# EAGLE design main (EAGLE 7.6.0)
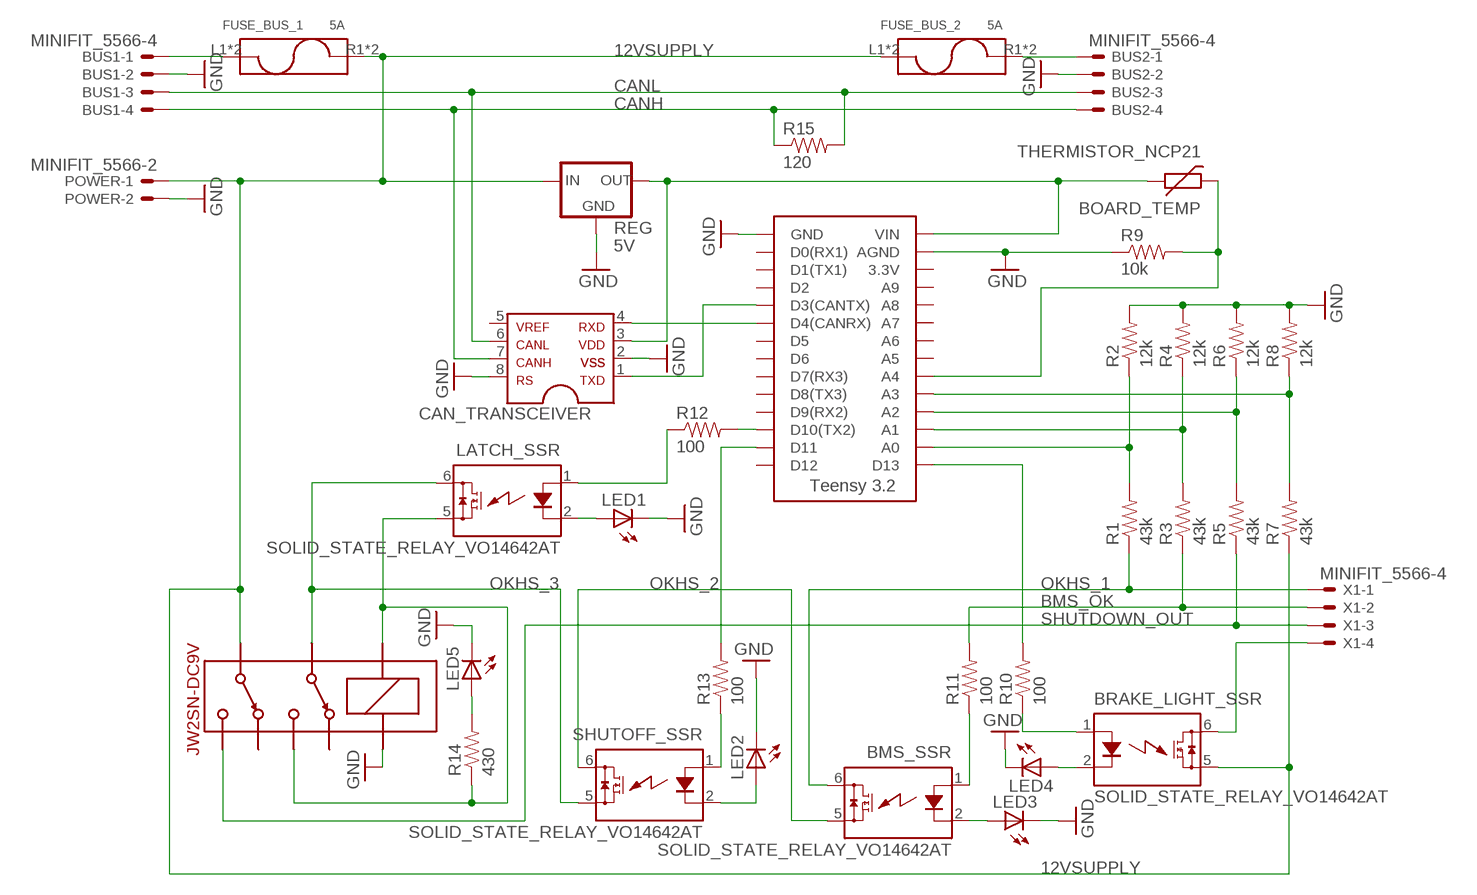
[diagram p0: schematic, sheet 1]

## Parts
BMS_SSR  SOLID_STATE_RELAY_VO14642AT  [DIL06]
BOARD_TEMP  THERMISTOR_NCP21  [0805]
BRAKE_LIGHT_SSR  SOLID_STATE_RELAY_VO14642AT  [DIL06]
BUS1  MINIFIT_5566-4  [MINIFIT_5566-4]
BUS2  MINIFIT_5566-4  [MINIFIT_5566-4]
CAN_TRANSCEIVER  MCP2551DIL  [DIL08]
FUSE_BUS_1  5A  FUSE_HOLDER  [FUSE_HOLDER]
FUSE_BUS_2  5A  FUSE_HOLDER  [FUSE_HOLDER]
IMD_SHUTDOWN  DPDT_RELAY_PANASONIC_JW2SN-DC9V  [DPDT_RELAY_PANASONIC_JW2SN]
LATCH_SSR  SOLID_STATE_RELAY_VO14642AT  [DIL06]
LED1  LED-0805  [LED-805]
LED2  LED-0805  [LED-805]
LED3  LED-0805  [LED-805]
LED4  LED-0805  [LED-805]
LED5  LED-0805  [LED-805]
POWER  MINIFIT_5566-2  [MINIFIT_5566-2]
R1  43k  RESISTOR0805-RES  [0805]
R2  12k  RESISTOR0805-RES  [0805]
R3  43k  RESISTOR0805-RES  [0805]
R4  12k  RESISTOR0805-RES  [0805]
R5  43k  RESISTOR0805-RES  [0805]
R6  12k  RESISTOR0805-RES  [0805]
R7  43k  RESISTOR0805-RES  [0805]
R8  12k  RESISTOR0805-RES  [0805]
R9  10k  RESISTOR0805-RES  [0805]
R10  100  RESISTOR0805-RES  [0805]
R11  100  RESISTOR0805-RES  [0805]
R12  100  RESISTOR0805-RES  [0805]
R13  100  RESISTOR0805-RES  [0805]
R14  430  RESISTOR0805-RES  [0805]
R15  120  RESISTOR0805-RES  [0805]
REG  5V  5V_REGULATOR_LM340-NLM340MPX-5.0/NOPB  [SOT223]
SHUTOFF_SSR  SOLID_STATE_RELAY_VO14642AT  [DIL06]
U$3  TEENSY_3.2_SIMPLE  [TEENSY_3.2_SIMPLE]
X1  MINIFIT_5566-4  [MINIFIT_5566-4]

## Nets
5VSUPPLY: BOARD_TEMP.1 CAN_TRANSCEIVER.3 REG.3(OUT) U$3.VIN
12VSUPPLY: BRAKE_LIGHT_SSR.5(IO2) FUSE_BUS_1.R1 FUSE_BUS_1.R2 FUSE_BUS_2.L1 FUSE_BUS_2.L2 IMD_SHUTDOWN.6 POWER.1 R7.1 REG.1(IN)
12VSUPPLY_READ: R7.2 R8.1 U$3.A3
BMS_OK: R3.1 R11.2 X1.2
BMS_OK_READ: R3.2 R4.1 U$3.A1
CANH: BUS1.4 BUS2.4 CAN_TRANSCEIVER.7 R15.1
CANL: BUS1.3 BUS2.3 CAN_TRANSCEIVER.6 R15.2
GND: BUS1.2 BUS2.2 CAN_TRANSCEIVER.2 CAN_TRANSCEIVER.8 IMD_SHUTDOWN.COIL+ LED1.C LED2.C LED3.C LED4.C LED5.C POWER.2 R2.2 R4.2 R6.2 R8.2 R9.1 REG.2(GND) REG.4(GND) U$3.AGND U$3.GND
N$1: LATCH_SSR.2(LED-) LED1.A
N$2: CAN_TRANSCEIVER.4 U$3.D4(CANRX)
N$3: CAN_TRANSCEIVER.1 U$3.D3(CANTX)
N$4: BRAKE_LIGHT_SSR.6(IO1) X1.4
N$5: R12.2 U$3.D10(TX2)
N$6: IMD_SHUTDOWN.4 IMD_SHUTDOWN.COIL- LATCH_SSR.5(IO2) R14.1
N$7: BRAKE_LIGHT_SSR.2(LED-) LED4.A
N$8: LATCH_SSR.1(LED+) R12.1
N$9: BMS_SSR.2(LED-) LED3.A
N$10: BUS1.1 FUSE_BUS_1.L1 FUSE_BUS_1.L2
N$11: BUS2.1 FUSE_BUS_2.R1 FUSE_BUS_2.R2
N$12: R13.1 SHUTOFF_SSR.1(LED+)
N$13: R10.2 U$3.D13
N$14: R13.2 U$3.D11
N$15: BOARD_TEMP.2 R9.2 U$3.A4
N$16: LED2.A SHUTOFF_SSR.2(LED-)
N$17: BRAKE_LIGHT_SSR.1(LED+) R10.1
N$18: BMS_SSR.1(LED+) R11.1
N$19: LED5.A R14.2
OKHS_1: BMS_SSR.6(IO1) R1.1 X1.1
OKHS_2: BMS_SSR.5(IO2) SHUTOFF_SSR.6(IO1)
OKHS_3: IMD_SHUTDOWN.3 LATCH_SSR.6(IO1) SHUTOFF_SSR.5(IO2)
OKHS_READ: R1.2 R2.1 U$3.A0
SHUTDOWN_OUT: IMD_SHUTDOWN.5 R5.1 X1.3
SHUTDOWN_OUT_READ: R5.2 R6.1 U$3.A2
Unconnected: CAN_TRANSCEIVER.5 IMD_SHUTDOWN.2 IMD_SHUTDOWN.7 U$3.3.3V U$3.A5 U$3.A6 U$3.A7 U$3.A8 U$3.A9 U$3.D0(RX1) U$3.D1(TX1) U$3.D2 U$3.D5 U$3.D6 U$3.D7(RX3) U$3.D8(TX3) U$3.D9(RX2) U$3.D12

## Library data of the parts
BMS_SSR BRAKE_LIGHT_SSR LATCH_SSR SHUTOFF_SSR = HyTechDevices:SOLID_STATE_RELAY
BOARD_TEMP = HyTechDevices:THERMISTOR_NCP21: Murata NCP21 10k Thermistor Datasheet <http://www.murata.com/~/media/webrenewal/support/library/catalog/products/thermistor/ntc/r44e.ashx>
BUS1 BUS2 X1 = HyTechDevices:MINIFIT_5566-4: Mini FIT Junior connector 4 pole Source: http://www.molex.com; OC_FARNELL: unknown; OC_NEWARK: unknown
CAN_TRANSCEIVER = HyTechDevices:MCP2551: MCP2551 High-Speed CAN Transceiver Product Webpage <https://www.microchip.com/wwwproducts/en/MCP2551> Datasheet <http://ww1.microchip.com/downloads/en/DeviceDoc/21667f.pdf> This device is outdated It is replaced by MCP2561. Comparison Page <https://www.microchip.com/wwwproducts/ProductCompare/MCP2551/MCP2561> Product Webpage <https://www.microchip.com/wwwproducts/en/MCP2561> Datasheet <http://ww1.microchip.com/downloads/en/DeviceDoc/20005167C.pdf>
FUSE_BUS_1 FUSE_BUS_2 = HyTechDevices:FUSE_HOLDER: Keystone Electronics 3568 Fuse Mouser Part <http://www.mouser.com/ProductDetail/Keystone-Electronics/3568> Datasheet <http://www.mouser.com/ds/2/215/568-742601.pdf>
IMD_SHUTDOWN = HyTechDevices:DPDT_RELAY_PANASONIC_JW2SN-DC9V: Double Pull Double Throw Relay 9VDC Datasheet <http://www.mouser.com/ds/2/316/jw-catalog-461998.pdf> Product Page <http://www.mouser.com/ProductDetail/Panasonic-Industrial-Devices/JW2SN-DC9V>
LED1-LED5 = HyTechDevices:LED: Light Emitting Diode Source: Dangerous Prototypes Eagle Library <https://github.com/DangerousPrototypes/Eagle_Part_Library>
POWER = HyTechDevices:MINIFIT_5566-2: Mini FIT Junior connector 2 pole Source: http://www.molex.com; OC_FARNELL: 1822072; OC_NEWARK: unknown
R1-R15 = HyTechDevices:RESISTOR: Resistor Basic schematic elements and footprints for 0603, 1206, and PTH resistors.
REG = HyTechDevices:5V_REGULATOR_LM340-N: Voltage Regulator 5v linear voltage regulator Datasheet <http://www.mouser.com/ProductDetail/Texas-Instruments/LM340MPX-50-NOPB/?qs=X1J7HmVL2ZGZwtTFRQ9ItA%3D%3D> MAX current out: 1.5A MAX voltage in: 35V
U$3 = HyTechDevices:TEENSY_3.2_SIMPLE: Simple version of the Teensy 3.2 board that only uses the 2 main rows of pins, not the inner pins or the pins opposite the usb port.

## Board
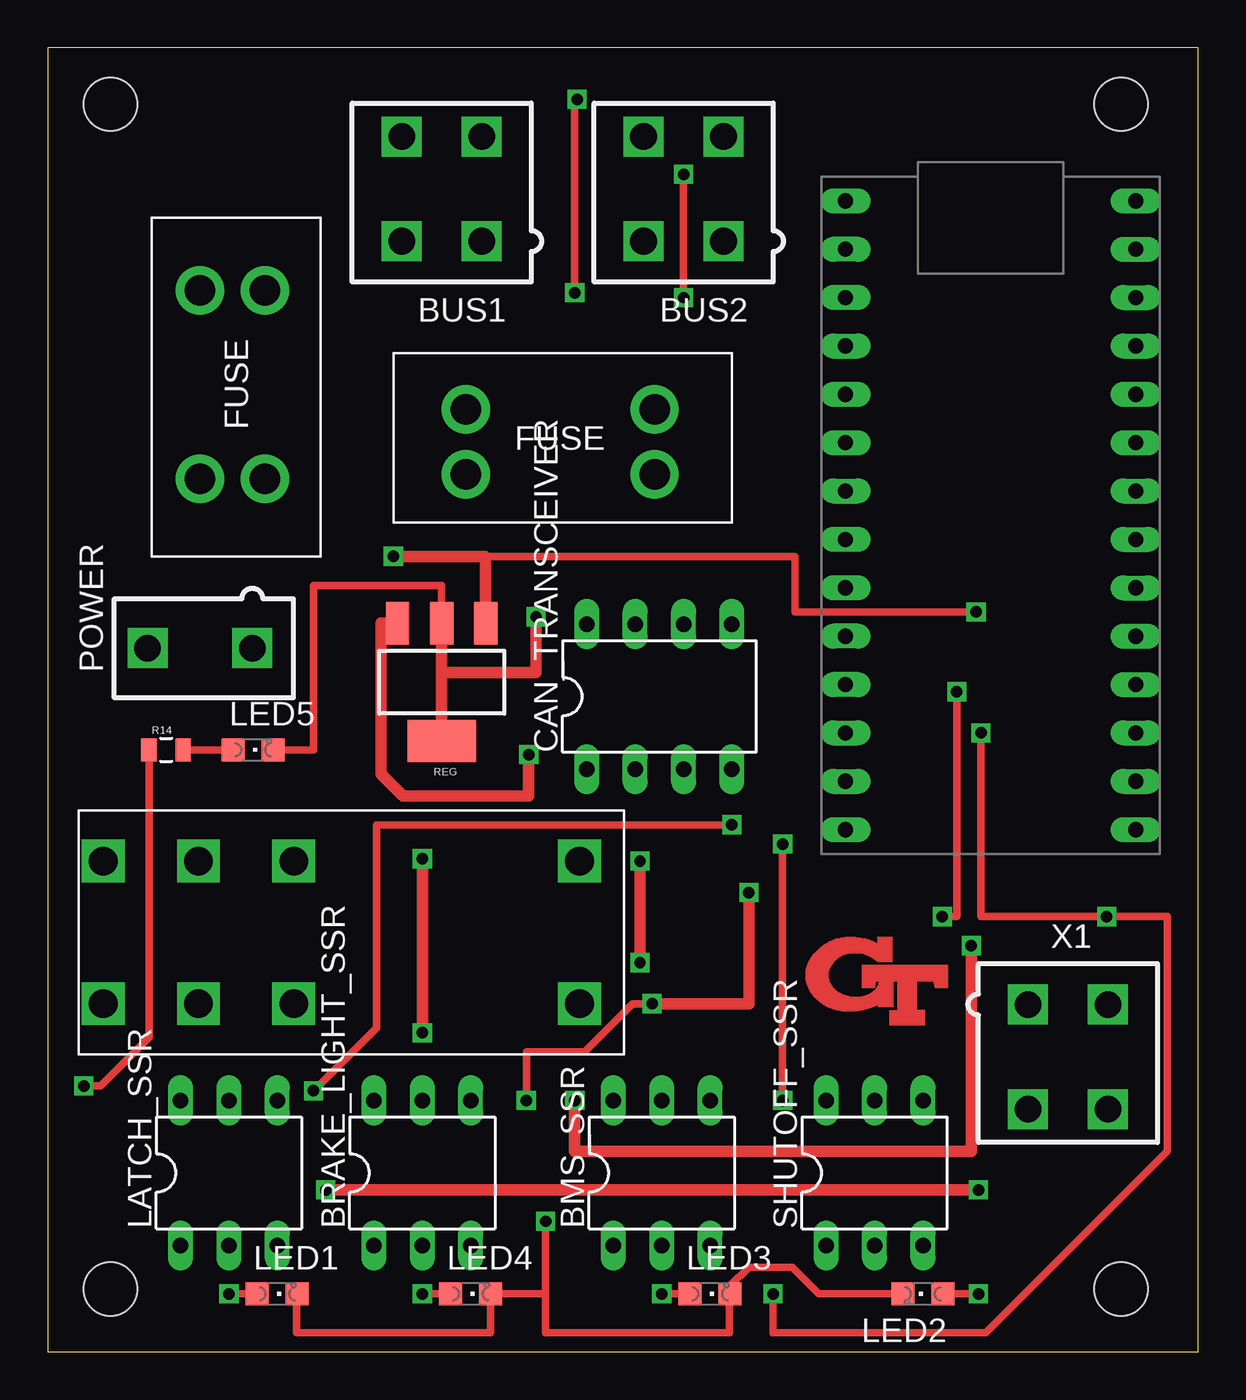
[diagram p1: board, top side]
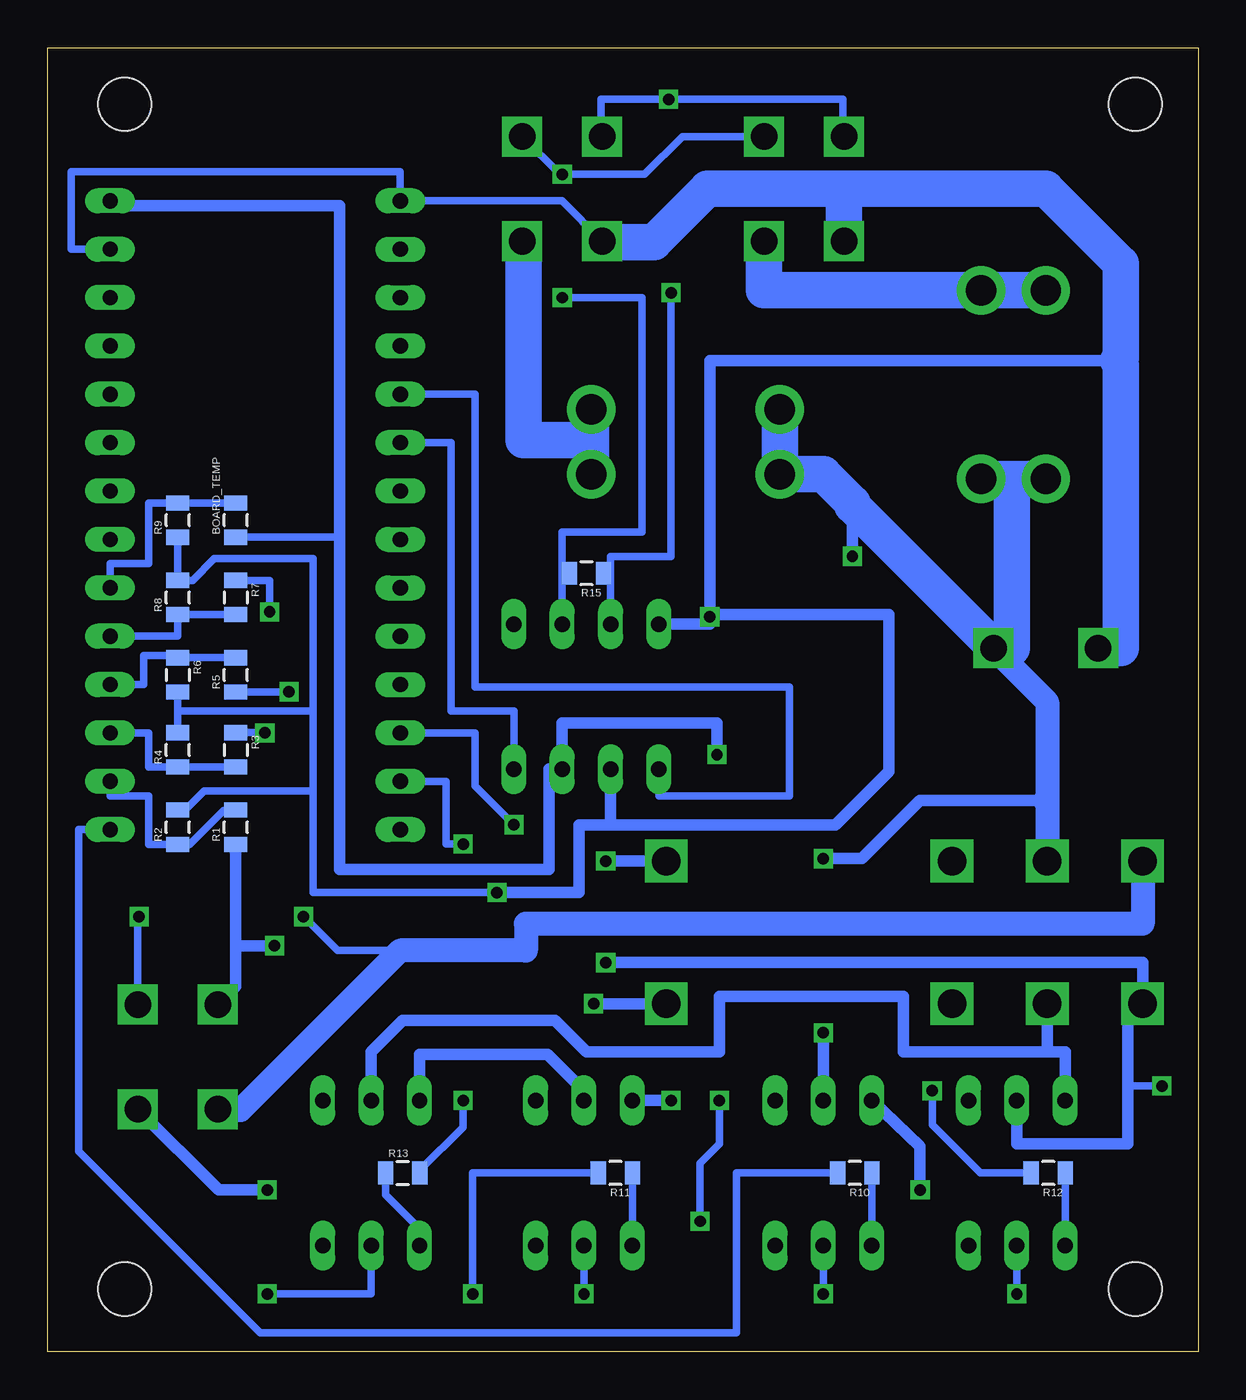
[diagram p2: board, bottom side, seen from below]

Size 60.43 x 68.5 mm. Coordinates in mm from the lower left corner, seen from the top.
Outline: 0,0 60.43,0 60.43,68.5 0,68.5 0,0
Copper layers (1*16): Top 0.035mm / dielectric 1.5mm / Bottom 0.035mm
Design rules "default": minimum track width 10mil, minimum drill 24mil, track to track 8mil, track to pad 8mil, pad to pad 8mil, via to via 8mil, smd to smd 8mil, copper to edge 40mil, drill to drill 8mil, minimum pad ring 10mil, minimum via ring 8mil, stop-mask expansion 4mil, vias tented up to drill 0mil, thermal gap 10mil
Holes 2.8 mm at 3.3,65.53 3.3,3.3 56.39,3.3 56.39,65.53

### Footprints (pad centres in the part's own frame; a part is rotated, then mirrored left to right if it is on the bottom)
DIL06 = drill 0.813 long: 1 -2.54,-3.81; 2 0,-3.81; 3 2.54,-3.81; 4 2.54,3.81; 5 0,3.81; 6 -2.54,3.81
0805 = smd 0.8 x 1.2: 1 -0.9,0; 2 0.9,0
MINIFIT_5566-4 = drill 1.4 square: 1 2.1,-2.75; 2 -2.1,-2.75; 3 2.1,2.75; 4 -2.1,2.75
DIL08 = drill 0.813 long: 1 -3.81,-3.81; 2 -1.27,-3.81; 3 1.27,-3.81; 4 3.81,-3.81; 5 3.81,3.81; 6 1.27,3.81; 7 -1.27,3.81; 8 -3.81,3.81
FUSE_HOLDER = drill 1.6 pad 2.54: L1 0,3.404; L2 0,0; R1 9.906,3.404; R2 9.906,0
DPDT_RELAY_PANASONIC_JW2SN = drill 1.5 square: 2 10.008,0; 3 5.004,0; 4 0,0; 5 0,7.493; 6 5.004,7.493; 7 10.008,7.493; COIL+ 25.019,0; COIL- 25.019,7.493
LED-805 = smd 1.2 x 1.2: A 0,-1.05; C 0,1.05
MINIFIT_5566-2 = drill 1.4 square: 1 0,-2.75; 2 0,2.75
SOT223 = smd 1.219 x 2.235: 1 -2.311,-3.099; 2 0,-3.099; 3 2.311,-3.099 | smd 3.6 x 2.2: 4 0,3.099
TEENSY_3.2_SIMPLE = drill 0.8 long: 3.3V 16.51,29.21; A0 16.51,3.81; A1 16.51,6.35; A2 16.51,8.89; A3 16.51,11.43; A4 16.51,13.97; A5 16.51,16.51; A6 16.51,19.05; A7 16.51,21.59; A8 16.51,24.13; A9 16.51,26.67; AGND 16.51,31.75; D0(RX1) 1.27,31.75; D1(TX1) 1.27,29.21; D2 1.27,26.67; D3(CANTX) 1.27,24.13; D4(CANRX) 1.27,21.59; D5 1.27,19.05; D6 1.27,16.51; D7(RX3) 1.27,13.97; D8(TX3) 1.27,11.43; D9(RX2) 1.27,8.89; D10(TX2) 1.27,6.35; D11 1.27,3.81; D12 1.27,1.27; D13 16.51,1.27; GND 1.27,34.29; VIN 16.51,34.29

### Placement (x,y rotation side)
BMS_SSR  32.26,9.4 0 top
BOARD_TEMP  50.55,43.69 90 bottom
BRAKE_LIGHT_SSR  19.68,9.4 0 top
BUS1  20.7,61.09 0 top
BUS2  33.4,61.09 0 top
CAN_TRANSCEIVER  32.13,34.42 0 top
FUSE_BUS_1  8,55.75 270 top
FUSE_BUS_2  21.97,46.1 0 top
IMD_SHUTDOWN  2.92,18.29 0 top
LATCH_SSR  9.53,9.4 0 top
LED1  12.06,3.05 270 top
LED2  45.97,3.05 90 top
LED3  34.8,3.05 270 top
LED4  22.23,3.05 270 top
LED5  10.79,31.62 270 top
POWER  8,36.96 90 top
R1  50.55,27.56 90 bottom
R2  53.59,27.56 90 bottom
R3  50.55,31.62 270 bottom
R4  53.59,31.62 90 bottom
R5  50.55,35.56 90 bottom
R6  53.59,35.56 270 bottom
R7  50.55,39.62 270 bottom
R8  53.59,39.62 90 bottom
R9  53.59,43.69 90 bottom
R10  18.03,9.4 180 bottom
R11  30.61,9.4 180 bottom
R12  7.87,9.4 180 bottom
R13  41.78,9.4 0 bottom
R14  6.22,31.62 0 top
R15  32.13,40.89 180 bottom
REG  20.7,35.18 180 top
SHUTOFF_SSR  43.43,9.4 0 top
U$3  40.64,26.16 0 top
X1  53.59,15.49 180 top

### Tracks (layer width: path | path; a pad name or v marks a point on that pad's centre or on a via)
5VSUPPLY  (via drill 0.6)
  Top 0.61: REG.3 17.53,38.28 17.53,30.35 18.67,29.21 25.27,29.21 v25.27,31.37
  Bottom 0.406: BOARD_TEMP.1 45.09,42.79 45.09,43.18
  Bottom 0.61: v25.27,31.37 25.27,33.02 33.4,33.02 CAN_TRANSCEIVER.3 34.09,30.61 34.09,25.35 45.09,25.35 45.09,43.18 45.09,60.2 57.15,60.2 U$3.VIN
12VSUPPLY  (via drill 0.6)
  Top 0.406: 22.99,41.78 39.24,41.78 39.24,38.86 v48.77,38.86
  Top 0.61: v18.16,41.78 22.99,41.78 23.01,41.76 REG.1 23.11,37.52 | v19.68,25.91 v19.68,16.76
  Bottom 0.406: R7.1 48.77,40.52 v48.77,38.86
  Bottom 0.61: v18.16,41.78 18.16,44.45 18.16,44.58 | v19.68,16.76 BRAKE_LIGHT_SSR.5 | 8.05,28.96 14.61,28.96 17.65,25.91 v19.68,25.91
  Bottom 1.27: POWER.1 7.92,34.13 7.92,28.83 | 7.92,28.83 IMD_SHUTDOWN.6 | 8.05,28.96 7.92,28.83
  Bottom 1.905: FUSE_BUS_2.L1 FUSE_BUS_2.L2 19.68,46.1 18.16,44.58 | FUSE_BUS_1.R2 FUSE_BUS_1.R1 9.78,45.85 9.78,36.96 POWER.1 10.75,37.17 10.88,37.17 18.16,44.45
12VSUPPLY_READ
  Bottom 0.406: R7.2 R8.1 53.59,37.59 U$3.A3
BMS_OK  (via drill 0.6)
  Top 0.406: v49.02,32.51 49.02,22.86 v55.63,22.86 58.8,22.86 58.8,10.54 49.28,1.02 38.1,1.02 v38.1,3.05
  Bottom 0.406: R3.1 49.02,32.52 v49.02,32.51 | v55.63,22.86 55.69,22.86 X1.2 | R11.2 38.1,9.4 v38.1,3.05
BMS_OK_READ
  Bottom 0.406: R3.2 R4.1 55.12,30.72 55.12,32.51 U$3.A1
CANH  (via drill 0.6)
  Top 0.406: v27.81,65.79 27.69,65.79 v27.69,55.63
  Bottom 0.406: BUS2.4 31.37,63.84 31.37,65.79 v27.81,65.79 18.67,65.79 18.67,63.84 BUS1.4 | v27.69,55.63 27.69,41.78 30.86,41.78 30.86,40.89 | 30.86,40.89 CAN_TRANSCEIVER.7 | R15.1 30.86,40.89
CANL  (via drill 0.6)
  Top 0.406: v33.4,55.37 v33.4,61.85
  Bottom 0.406: BUS2.3 33.51,61.85 v33.4,61.85 29.08,61.85 27.09,63.84 BUS1.3 | v33.4,55.37 29.21,55.37 29.21,43.05 33.4,43.05 33.4,40.89 | 33.4,40.89 CAN_TRANSCEIVER.6 | R15.2 33.4,40.89
GND  (via drill 0.6)
  Top 0.406: v31.75,18.29 30.73,18.29 28.19,15.75 25.15,15.75 v25.15,13.21 | 26.16,3.05 LED4.C 23.27,1.02 13.08,1.02 13.08,3.05 LED1.C | 26.16,3.05 v26.16,6.86 | 26.16,3.05 26.16,1.02 35.81,1.02 35.81,3.05 LED3.C 35.85,3.46 36.83,4.45 39.12,4.45 40.51,3.05 LED2.C | REG.2 20.7,40.26 13.97,40.26 13.97,31.62 LED5.C
  Top 0.61: v31.75,18.29 36.83,18.29 v36.83,24.13 | REG.2 20.7,35.69 | 20.7,35.69 25.65,35.69 v25.65,38.61 | REG.4 20.7,35.69
  Bottom 0.406: BUS2.2 33.42,60.45 U$3.GND 41.91,61.98 59.18,61.98 59.18,57.91 U$3.AGND | R9.1 R8.2 | R4.2 53.59,33.53 | 53.59,33.53 R6.2 | R8.2 52.82,40.52 51.69,41.66 46.48,41.66 46.48,33.66 | 46.48,33.66 53.47,33.66 53.59,33.53 | R2.2 53.2,28.46 52.2,29.46 46.48,29.46 | 46.48,29.46 46.48,33.66 | 53.59,40.39 R8.2 | 46.48,29.46 46.48,24.13 v36.83,24.13 | 25.65,38.73 v25.65,38.61 25.65,38.23 | 4.19,52.07 4.06,51.82 | v26.16,6.86 26.16,9.91 25.15,10.92 v25.15,13.21
  Bottom 0.61: 30.86,27.69 19.05,27.69 16.26,30.48 16.26,38.73 25.65,38.73 | 30.86,27.69 CAN_TRANSCEIVER.2 | v36.83,24.13 32.51,24.13 32.51,27.69 30.86,27.69 | v25.65,38.61 25.65,52.07 4.19,52.07 | CAN_TRANSCEIVER.8 25.65,38.23 | IMD_SHUTDOWN.COIL+ v31.75,18.29
  Bottom 1.905: 18.6,61.09 BUS1.2 | POWER.2 4.06,36.96 4.06,51.82 | 18.6,61.09 25.78,61.09 28.57,58.29 31.26,58.29 BUS2.2 | 18.6,61.09 8,61.09 4.06,57.15 4.06,52.2 4.19,52.07
N$1  (via drill 0.6)
  Top 0.406: v9.53,3.05 LED1.A
  Bottom 0.406: LATCH_SSR.2 v9.53,3.05
N$2
  Bottom 0.406: CAN_TRANSCEIVER.4 35.94,33.66 39.24,33.66 39.24,47.75 U$3.D4(CANRX)
N$3
  Bottom 0.406: CAN_TRANSCEIVER.1 28.32,29.21 21.46,29.21 21.46,34.92 37.97,34.92 37.97,50.29 U$3.D3(CANTX)
N$4  (via drill 0.6)
  Top 0.61: v14.61,8.51 v48.9,8.51
  Bottom 0.61: X1.4 51.46,8.51 v48.9,8.51 | v14.61,8.51 14.61,10.79 BRAKE_LIGHT_SSR.6
N$5  (via drill 0.6)
  Top 0.406: v35.94,27.69 17.27,27.69 17.27,17.02 v13.97,13.72
  Bottom 0.406: U$3.D10(TX2) 37.97,32.51 37.97,29.72 v35.94,27.69 | v13.97,13.72 13.97,11.94 11.43,9.4 R12.2
N$6  (via drill 0.6)
  Top 0.406: v1.91,13.97 2.79,13.97 5.33,16.51 5.33,31.61 R14.1
  Top 0.61: v31.11,25.78 v31.11,20.45
  Bottom 0.406: 3.68,13.98 v1.91,13.98 v1.91,13.97
  Bottom 0.61: LATCH_SSR.5 9.53,10.92 3.68,10.92 3.68,13.98 3.68,18.29 IMD_SHUTDOWN.4 2.92,20.45 v31.11,20.45 | IMD_SHUTDOWN.COIL- v31.11,25.78
N$7  (via drill 0.6)
  Top 0.406: v19.68,3.05 LED4.A
  Bottom 0.406: BRAKE_LIGHT_SSR.2 v19.68,3.05
N$8
  Bottom 0.406: R12.1 6.99,9.4 LATCH_SSR.1
N$9  (via drill 0.6)
  Top 0.406: v32.26,3.05 LED3.A
  Bottom 0.406: BMS_SSR.2 v32.26,3.05
N$10
  Bottom 1.905: FUSE_BUS_1.L2 FUSE_BUS_1.L1 22.8,55.75 BUS1.1
N$11
  Bottom 1.905: FUSE_BUS_2.R2 FUSE_BUS_2.R1 31.88,47.88 35.43,47.88 35.43,58.34 BUS2.1
N$12
  Bottom 0.406: SHUTOFF_SSR.1 40.89,6.48 42.67,8.26 42.67,9.39 R13.1
N$13
  Bottom 0.406: R10.2 24.26,9.4 24.26,1.02 49.28,1.02 58.8,10.54 58.8,27.43 U$3.D13
N$14  (via drill 0.6)
  Top 0.406: v38.61,26.67 v38.61,13.21
  Bottom 0.406: v38.61,26.67 39.5,26.67 39.5,29.97 U$3.D11 | R13.2 40.88,9.53 38.61,11.8 v38.61,13.21
N$15
  Bottom 0.406: BOARD_TEMP.2 R9.2 55.12,44.59 55.12,41.4 57.15,41.4 U$3.A4
N$16  (via drill 0.6)
  Top 0.406: v48.9,3.05 LED2.A
  Bottom 0.406: SHUTOFF_SSR.2 43.43,3.05 v48.9,3.05
N$17
  Bottom 0.406: R10.1 17.14,9.4 BRAKE_LIGHT_SSR.1
N$18
  Bottom 0.406: BMS_SSR.1 29.71,5.59 R11.1
N$19
  Top 0.406: R14.2 LED5.A
OKHS_1  (via drill 0.6)
  Top 0.61: v48.51,21.34 48.51,10.54 27.69,10.54 v27.69,13.21
  Bottom 0.406: R1.1 50.81,26.66 50.81,26.41
  Bottom 0.61: R1.1 50.55,21.34 | X1.1 50.55,19.19 50.55,21.34 | 50.55,21.34 v48.51,21.34 | v27.69,13.21 BMS_SSR.6
OKHS_2
  Bottom 0.61: BMS_SSR.5 32.26,13.72 34.16,15.62 40.89,15.62 SHUTOFF_SSR.6
OKHS_3
  Bottom 0.61: 7.92,15.75 IMD_SHUTDOWN.3 | LATCH_SSR.6 6.99,15.75 7.92,15.75 | 7.92,15.75 15.49,15.75 15.49,18.67 25.15,18.67 25.15,15.75 32.13,15.75 33.78,17.4 41.78,17.4 43.43,15.75 SHUTOFF_SSR.5
OKHS_READ
  Bottom 0.406: R1.2 50.56,28.45 51.18,28.45 52.97,26.66 R2.1 55.12,26.66 55.12,29.21 57.15,29.21 U$3.A0
SHUTDOWN_OUT  (via drill 0.6)
  Top 0.406: v46.99,22.86 47.75,22.86 v47.75,34.67
  Bottom 0.406: R5.1 48.91,34.66 v47.75,34.67 | 41.91,21.08 45.21,21.08 v46.99,22.86
  Bottom 1.27: IMD_SHUTDOWN.5 2.92,22.48 35.31,22.48 35.31,21.08 41.91,21.08 50.29,12.7 51.45,12.7 X1.3
SHUTDOWN_OUT_READ
  Bottom 0.406: R5.2 R6.1 53.59,36.58 55.37,36.58 55.37,35.05 U$3.A2
(copper drawn outside any net)
  shapes: Top area x375